# Altium project Modbus_controller.PrjPcb (part 2 of 2)

## Sheet RS_485.SchDoc
size A4; SheetNumber: 6; SheetTotal: 6
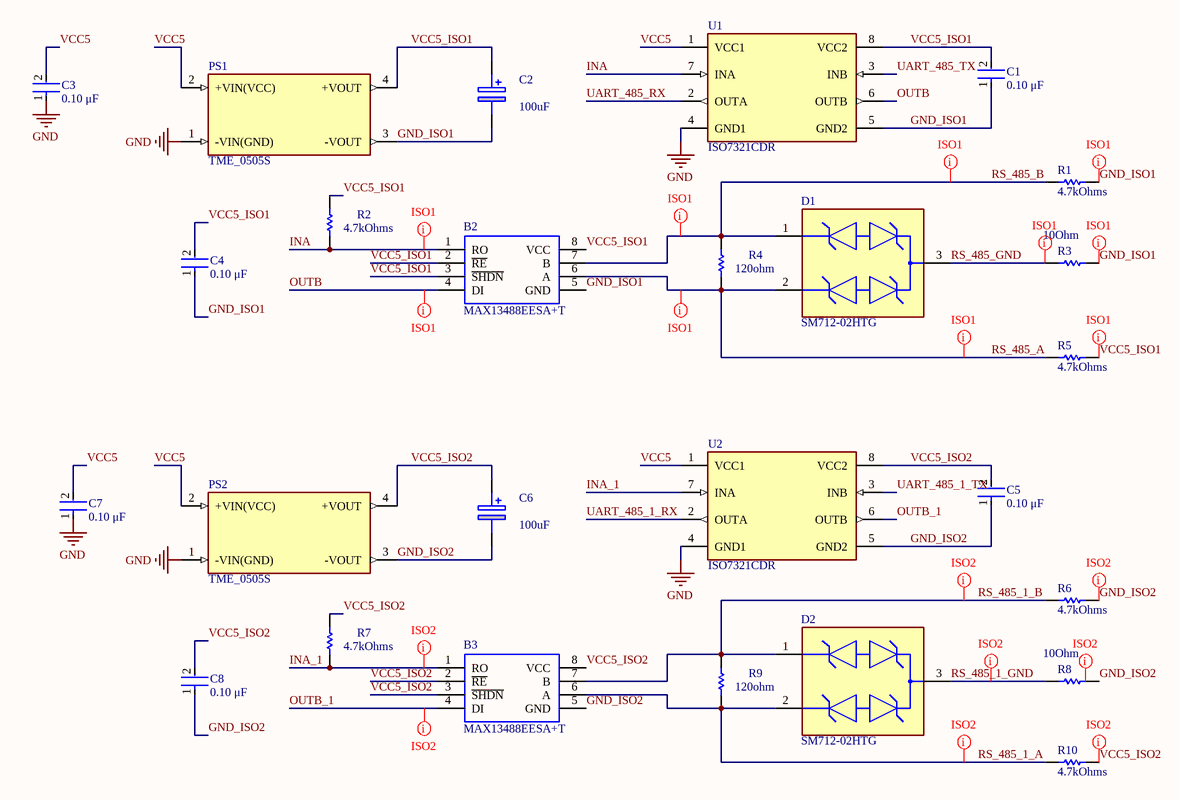
[diagram p5: RS_485.SchDoc]

### Parts
B2  MAX13488EESA+T  [SOIC127P600X175-8N]
B3  MAX13488EESA+T  [SOIC127P600X175-8N]
C1  value 0.10 μF  [FP-C0805C-DN-MFG]  (hidden comment: C0805C104K5RAC7411)
C2  Capacitance: 100uF  [T520B]  (hidden comment: T520B107M006ATE040)
C3  value 0.10 μF  [FP-C0805C-DN-MFG]  (hidden comment: C0805C104K5RAC7411)
C4  value 0.10 μF  [FP-C0805C-DN-MFG]  (hidden comment: C0805C104K5RAC7411)
C5  value 0.10 μF  [FP-C0805C-DN-MFG]  (hidden comment: C0805C104K5RAC7411)
C6  Capacitance: 100uF  [T520B]  (hidden comment: T520B107M006ATE040)
C7  value 0.10 μF  [FP-C0805C-DN-MFG]  (hidden comment: C0805C104K5RAC7411)
C8  value 0.10 μF  [FP-C0805C-DN-MFG]  (hidden comment: C0805C104K5RAC7411)
D1  SM712-02HTG  [FP-SM712-MFG]
D2  SM712-02HTG  [FP-SM712-MFG]
PS1  TME_0505S  [CONV_TME_0505S]
PS2  TME_0505S  [CONV_TME_0505S]
R1  Resistance: 4.7kOhms  [RESC1608X55X25LL10T15]  (hidden comment: RC0603FR-074K7L)
R2  Resistance: 4.7kOhms  [RESC1608X55X25LL10T15]  (hidden comment: RC0603FR-074K7L)
R3  Resistance: 10Ohm  [RESC2013X60X35ML10T20]  (hidden comment: RC0805FR-0710RL)
R4  Resistance: 120ohm  [RESC3116X65X40LL10T20]  (hidden comment: RC1206FR-07120RL)
R5  Resistance: 4.7kOhms  [RESC1608X55X25LL10T15]  (hidden comment: RC0603FR-074K7L)
R6  Resistance: 4.7kOhms  [RESC1608X55X25LL10T15]  (hidden comment: RC0603FR-074K7L)
R7  Resistance: 4.7kOhms  [RESC1608X55X25LL10T15]  (hidden comment: RC0603FR-074K7L)
R8  Resistance: 10Ohm  [RESC2013X60X35ML10T20]  (hidden comment: RC0805FR-0710RL)
R9  Resistance: 120ohm  [RESC3116X65X40LL10T20]  (hidden comment: RC1206FR-07120RL)
R10  Resistance: 4.7kOhms  [RESC1608X55X25LL10T15]  (hidden comment: RC0603FR-074K7L)
U1  ISO7321CDR  [FP-D0008B-MFG]
U2  ISO7321CDR  [FP-D0008B-MFG]

### Nets
GND: C3.1 C7.1 PS1.1(-VIN(GND)) PS2.1(-VIN(GND)) U1.4(GND1) U2.4(GND1)
GND_ISO1: B2.5(GND) C1.1 C2.2(-) C4.1 PS1.3(-VOUT) R1.1 R3.2 U1.5(GND2)
GND_ISO2: B3.5(GND) C5.1 C6.2(-) C8.1 PS2.3(-VOUT) R6.1 R8.2 U2.5(GND2)
INA: B2.1(RO) R2.1 U1.7(INA)
INA_1: B3.1(RO) R7.1 U2.7(INA)
OUTB: B2.4(DI) U1.6(OUTB)
OUTB_1: B3.4(DI) U2.6(OUTB)
RS_485_1_A: B3.6(A) D2.2 R9.1 R10.2
RS_485_1_B: B3.7(B) D2.1 R6.2 R9.2
RS_485_1_GND: D2.3 R8.1
RS_485_A: B2.6(A) D1.2 R4.1 R5.2
RS_485_B: B2.7(B) D1.1 R1.2 R4.2
RS_485_GND: D1.3 R3.1
UART_485_1_RX: U2.2(OUTA)
UART_485_1_TX: U2.3(INB)
UART_485_RX: U1.2(OUTA)
UART_485_TX: U1.3(INB)
VCC5: C3.2 C7.2 PS1.2(+VIN(VCC)) PS2.2(+VIN(VCC)) U1.1(VCC1) U2.1(VCC1)
VCC5_ISO1: B2.2(~{RE}) B2.3(~{SHDN}) B2.8(VCC) C1.2 C2.1(+) C4.2 PS1.4(+VOUT) R2.2 R5.1 U1.8(VCC2)
VCC5_ISO2: B3.2(~{RE}) B3.3(~{SHDN}) B3.8(VCC) C5.2 C6.1(+) C8.2 PS2.4(+VOUT) R7.2 R10.1 U2.8(VCC2)

### Layout directives
net class ISO1: GND_ISO1, INA, OUTB, RS_485_A, RS_485_B, RS_485_GND, VCC5_ISO1
net class ISO2: (no net found under the mark), GND_ISO2, INA_1, OUTB_1, RS_485_1_A, RS_485_1_B, RS_485_1_GND, VCC5_ISO2

### Library data of the parts
B2 B3 = MAX13488EESA+T: MAXIM INTEGRATED PRODUCTS - MAX13488EESA+T - Transceiver RS422, RS485, 4.75V-5.25V supply, 1 Driver, NSOIC-8; Geometry.Height: 1.75mm; Mouser Part Number: 700-MAX13488EESAT; Mouser Price/Stock: https://www.mouser.co.uk/ProductDetail/Maxim-Integrated/MAX13488EESA%2bT?qs=CDqwynd4ZNrf75a2RFzJTw%3D%3D; Manufacturer_Name: Maxim Integrated; Manufacturer_Part_Number: MAX13488EESA+T; Datasheet Link: https://datasheets.maximintegrated.com/en/ds/MAX13487E-MAX13488E.pdf
C1 C3-C5 C7 C8 = CMP-2007-00277-3: C0805 0.10 μF X7R 30ppm/°C 10.00% 50 V; Manufacturer: KEMET; Material: Ceramic; Tolerance: 0.1; Voltage Rating: 50 V; Temperature: -55°C to +125°C; Device Class L3: Ceramic Capacitors; Temperature Characteristic: X7R; Device Class L1: Passive Components; Category: Cap; Temperature Coefficient: 30ppm/°C; Manufacturer Part Number: C0805C104K5RAC7411; Temperature Range High: +125°C; Height: 0.88mm; RoHS: TRUE; ComponentLink2Description: Datasheet; Lead Free: Yes; Capacitance: 0.10 μF; Package: C0805C-DN; Temperature Range Low: -55°C; ComponentLink2URL: https://content.kemet.com/datasheets/KEM_C1003_C0G_SMD.pdf; Automotive: No; Ipc Land Pattern Name: CAPC200125X78; Octopart: https://octopart.com/c0805c104k5rac7411-kemet-18508045; Device Class L2: Capacitors
C2 C6 = T520B107M006ATE040: T520, Tantalum, Polymer Tantalum, Commercial Grade, 100 uF, 20%, 6.3 VDC, 105C, -55C, 105C, SMD, Polymer, Molded, Low ESR, Non-Combustible, 2,000 Hrs, 8 % , 40 mOhms, 63 uA, 94.85 mg, 3528, 1.9mm, Height Max = 2mm, 2000, 52  Weeks; Manufacturer_Name: KEMET; Mouser Part Number: 80-T520B107M6ATE40; Mouser Price/Stock: https://www.mouser.co.uk/ProductDetail/KEMET/T520B107M006ATE040?qs=A%2FUypIgi4aDLVIJ%2FABrGAw%3D%3D; Manufacturer_Part_Number: T520B107M006ATE040; Datasheet Link: https://content.kemet.com/datasheets/KEM_T2076_T52X-530.pdf; Geometry.Height: 2mm
D1 D2 = CMP-2000-07561-2: TVS DIODE 12V 31V SOT23-3; Leakage Current: 20uA; Polarity: Bidirectional; Breakdown Voltage: 13.3V; Max Power Dissipation: 600W; Number of Channels: 2; Max Surge Current: 19A; Capacitance: 75pF; Power Line Protection: No; Element Configuration: Dual; Number of Pins: 3; Radiation Hardening: No; Clamping Voltage: 31V; Mount: Surface Mount; Reverse Standoff Voltage: 12V; Peak Pulse Power: 600W; Lead Free: Lead Free; Direction: Bidirectional; Packaging: Tape and Reel; Case/Package: SOT-23-3; Number of Bidirectional Channels: 2; Termination: SMD/SMT; Max Operating Temperature: 125°C; Min Breakdown Voltage: 13.3V; Depth: 1.4mm; Package Quantity: 3000; Working Voltage: 12V; Length: 3.04mm; Peak Pulse Current: 19A; Composition: Zener; Min Operating Temperature: -40°C
PS1 PS2 = TME_0505S: 1 Watt DC/DC converter, industrial, 10% input, unregulated, encapsulated, SIP-4 package; MF: Traco Power; MP: TME 0505S; Value: *; Price: None; Package: SIP-4 Traco Power; SnapEDA_Link: https://www.snapeda.com/parts/TME%200505S/Traco%20Power/view-part/521108/?ref=snap; Check_prices: https://www.snapeda.com/parts/TME%200505S/Traco%20Power/view-part/521108/?ref=eda; Availability: In Stock; Purchase-URL: https://pricing.snapeda.com/search/part/TME 0505S/?ref=eda
R1 R2 R5-R7 R10 = CMP-2000-06942-1: Chip Resistor, 4.7 KOhm, +/- 1%, 0.1 W, -55 to 155 degC, 0603 (1608 Metric), RoHS, Tape and Reel; Manufacturer: Yageo; Power Rating: 100mW; Temperature Coefficient: 100PPM/C; Voltage Rating: 50V; Package Reference: 0603; Series: RC; Datasheet Version: Rev. 7, 05/2017; Packaging: Reel; Termination Style: SMD/SMT; Datasheet URL: http://www.yageo.com/documents/recent/PYu-RC_Group_51_RoHS_L_7.pdf; Manufacturer URL: http://www.yageo.com/; Package Description: 2-Pin Surface Mount Device, Body 1.6 x 0.8 mm; Case Code - mm: 1608; Case Code - in: 0603; Mounting Technology: SurfaceMount; Operating Temperature Range: -55Cto+155C; Tolerance: 1%; Product: ThickFilmResistorsGeneralPurpose
R3 R8 = CMP-2100-03670-1: Chip Resistor, 10 Ohm, +/- 1%, 0.125 W, -55 to 155 degC, 0805 (2012 Metric), RoHS, Tape and Reel; Manufacturer: Yageo; Power Rating: 125mW; Voltage Rating: 150V; Temperature Coefficient: 200ppm/degreesC; Number of Pins: 2; REACH SVHC: NoSVHC; Datasheet Version: Rev. 5, 10/2016; Max Operating Temperature: 155degC; Manufacturer URL: http://www.yageo.com/; Case Code (Imperial): 0805; Package Description: 2-Pin Surface Mounted Device, Body 2 x 1.25 mm; Case Code (Metric): 2012; Length: 2mm; RoHSCompliant: true; Max Power Dissipation: 125mW; Depth: 1.25mm; Packaging: TapeandReel; Height: 0.5mm; Package Reference: 0805; Package Quantity: 1; Tolerance: 1%; Termination: SMD/SMT; Min Operating Temperature: -55degC; Lead Free: LeadFree; Width: 1.25mm; Voltage Rating (DC): 150V; Datasheet URL: http://www.yageo.com/NewPortal/yageodocoutput?fileName=/pdf/R-Chip/PYu-RC_Group_51_RoHS_L_5.pdf; Composition: ThickFilm; Number of Terminations: 2; Case/Package: 0805
R4 R9 = CMP-2000-06965-1: Chip Resistor, 120 Ohm, +/- 1%, 250 mW, -55 to 155 degC, 1206 (3216 Metric), RoHS, Tape and Reel; Manufacturer: Yageo; Resistor Element Type: ThickFilm; Voltage Rating: 200V; Temperature Coefficient: ±100ppm/°C; Power Rating: 250mW; Product Range: RCSeries; SVHC: ToBeAdvised; Resistor Case Style: 1206[3216Metric]; Package Reference: 1206; Resistance Tolerance: ±1%; Package Description: 2-Pin Surface Mount Device, Body 3.1 x 1.6 mm; Manufacturer URL: http://www.yageo.com/; MSL: MSL1-Unlimited; Packaging: CutTape; Datasheet URL: http://www.yageo.com/documents/recent/PYu-RC_Group_51_RoHS_L_7.pdf; Mounting Technology: SurfaceMount; Datasheet Version: Rev. 7, 05/2017
U1 U2 = CMP-04872-000214-1: DGTL ISO 3000VRMS 2CH GP 8SOIC; Pulse Width Distortion (PWD): 4ns; Channel Type: Unidirectional; Number of Channels: 2; Min Supply Voltage: 3V; Max Supply Voltage: 5.5V; Data Rate: 25Mbps; Propagation Delay: 57ns; Isolated Power: No; Min Operating Temperature: -40°C; Lead Free: Lead Free; RoHS Compliant: Yes; Number of Pins: 8; Type: General Purpose; Max Operating Temperature: 125°C; Contact Plating: Gold; REACH SVHC: No SVHC; Mount: Surface Mount; Packaging: Cut Tape; Case/Package: SOIC

## Nets that join several sheets
GND: MainPage (37 pins), RS_232 (6 pins), InputCircuits (11 pins), InputCircuits1 (8 pins), indication (6 pins), RS_485 (6 pins)
An_IN1: MainPage (B1.14), InputCircuits (C14.1 C15.2 D3.2 R11.1)
Analog_4_20_IN: MainPage (J3.1), InputCircuits (R11.2 R14.2)
D_IN1: MainPage (B1.22), InputCircuits (B6.4 R16.1), indication (LED7.1)
D_IN2: MainPage (B1.23), InputCircuits (B9.4 R22.1), indication (LED8.1)
D_IN3: MainPage (B1.24), InputCircuits (B11.4 R26.1), indication (LED9.1)
D_IN4: MainPage (B1.25), InputCircuits (B5.4 R13.1), indication (LED10.1)
D_IN5: MainPage (B1.26), InputCircuits (B7.4 R18.1), indication (LED11.1)
D_IN6: MainPage (B1.27), InputCircuits (B8.4 R20.1), indication (LED12.1)
D_IN7: MainPage (B1.28), InputCircuits (B10.4 R24.1), indication (LED13.1)
D_IN8: MainPage (B1.29 B1.54), InputCircuits1 (B12.4 R28.1)
D_IN9: MainPage (B1.30 B1.39), InputCircuits1 (B13.4 R30.1)
D_IN10: MainPage (B1.15 B1.33), InputCircuits1 (B14.4 R32.1)
D_IN11: MainPage (B1.34), InputCircuits1 (B15.4 R34.1), indication (LED14.1)
Digital_GND: MainPage (J5.8), InputCircuits (7 pins)
Digital_IN1: MainPage (J5.1), InputCircuits (R15.1)
Digital_IN2: MainPage (J5.2), InputCircuits (R21.1)
Digital_IN3: MainPage (J5.3), InputCircuits (R25.1)
Digital_IN4: MainPage (J5.4), InputCircuits (R12.1)
Digital_IN5: MainPage (J5.5), InputCircuits (R17.1)
Digital_IN6: MainPage (J5.6), InputCircuits (R19.1)
Digital_IN7: MainPage (J5.7), InputCircuits (R23.1)
Digital_IN8: MainPage (J3.6), InputCircuits1 (R27.1)
Digital_IN9: MainPage (J4.3), InputCircuits1 (R29.1)
Digital_IN10: MainPage (J4.7), InputCircuits1 (R31.1)
Digital_IN11: MainPage (J4.5), InputCircuits1 (R33.1)
LED1: MainPage (B1.41), indication (R58.1)
LED2: MainPage (B1.40), indication (R59.1)
LED3: MainPage (B1.38), indication (R60.1)
LED4: MainPage (B1.37), indication (R61.1)
LED5: MainPage (B1.36), indication (R62.1)
LED6: MainPage (B1.35), indication (R63.1)
RS_485_1_A: MainPage (J1.4), RS_485 (B3.6 D2.2 R9.1 R10.2)
RS_485_1_B: MainPage (J1.6), RS_485 (B3.7 D2.1 R6.2 R9.2)
RS_485_1_GND: MainPage (J1.5), RS_485 (D2.3 R8.1)
RS_485_A: MainPage (J1.1), RS_485 (B2.6 D1.2 R4.1 R5.2)
RS_485_B: MainPage (J1.3), RS_485 (B2.7 D1.1 R1.2 R4.2)
RS_485_GND: MainPage (J1.2), RS_485 (D1.3 R3.1)
UART_232_CTS: MainPage (B1.44), RS_232 (B4.10)
UART_232_RTS: MainPage (B1.45), RS_232 (B4.11)
UART_232_RXD: MainPage (B1.43), RS_232 (B4.13)
UART_232_TXD: MainPage (B1.42), RS_232 (B4.12)
UART_485_1_RX: MainPage (B1.17), RS_485 (U2.2)
UART_485_1_TX: MainPage (B1.16), RS_485 (U2.3)
UART_485_RX: MainPage (B1.52), RS_485 (U1.2)
UART_485_TX: MainPage (B1.51), RS_485 (U1.3)
VCC3V3: MainPage (13 pins), RS_232 (B4.17 B4.18 C11.2), InputCircuits (7 pins), InputCircuits1 (R28.2 R30.2 R32.2 R34.2), indication (8 pins)
VCC5: MainPage (5 pins), RS_485 (6 pins)